# Altium schematic sheet Sensors.SchDoc
size 420 x 297 mm
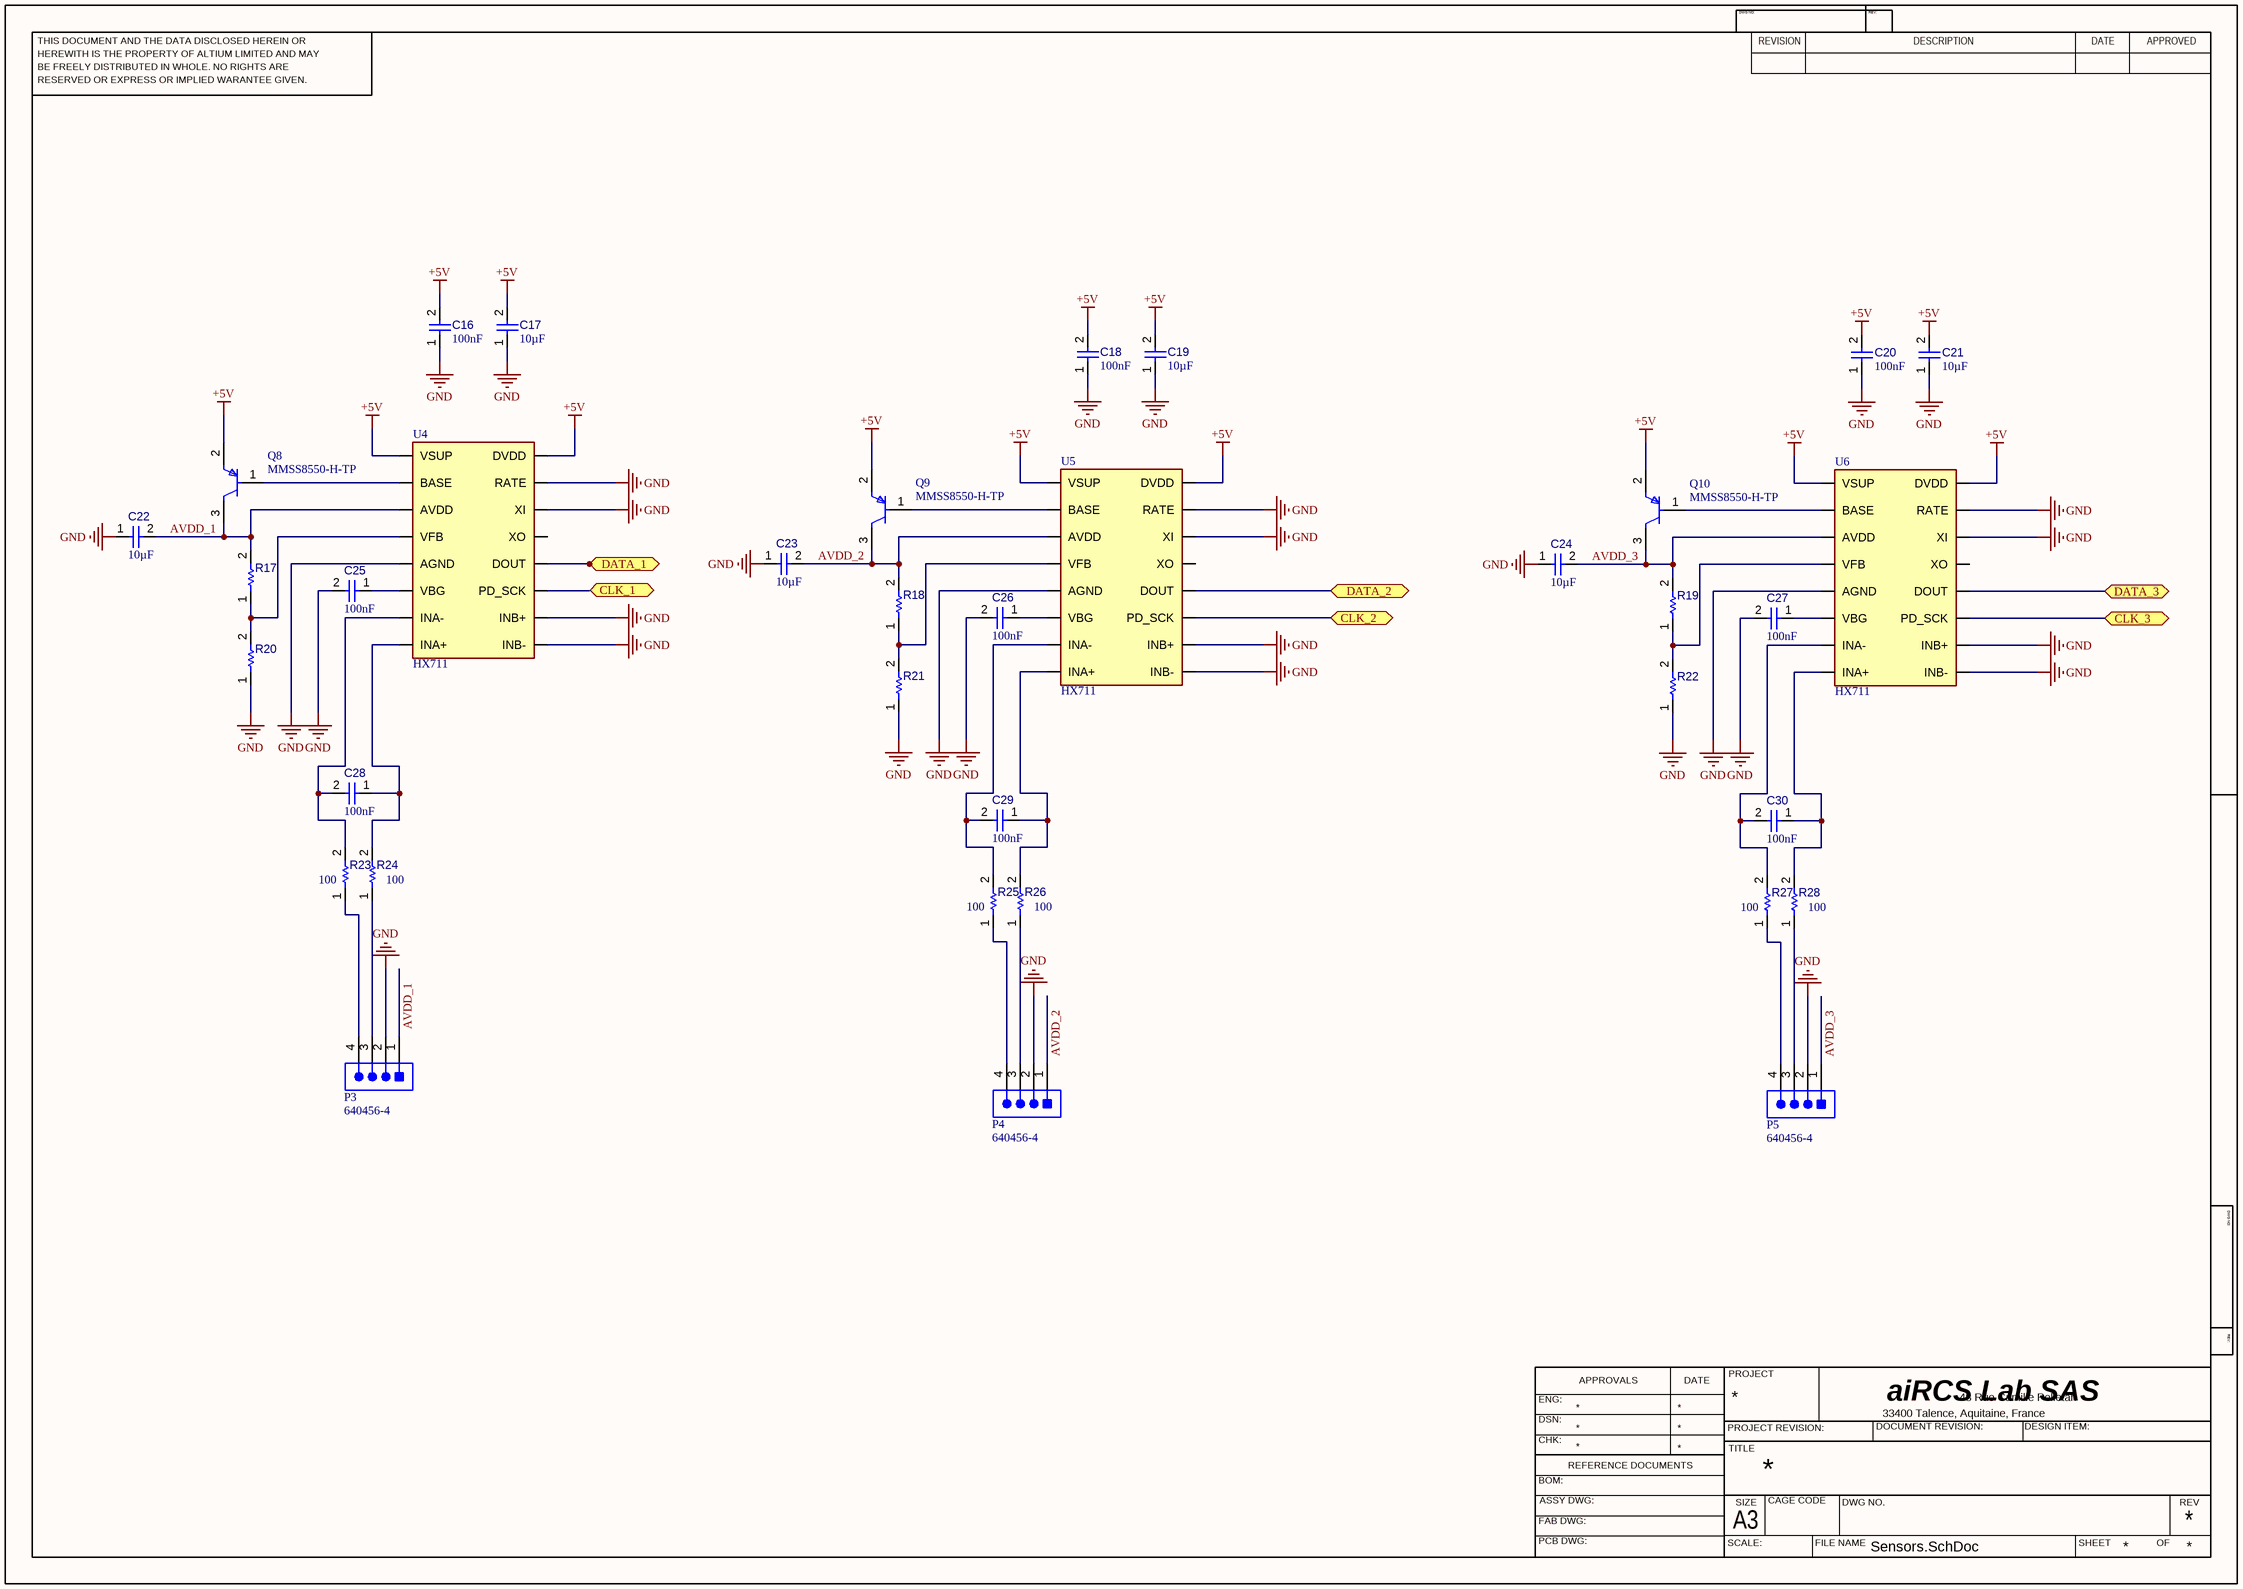
[diagram p0: Sensors.SchDoc]

## Parts
C16  value 100nF  [CAPC0402(1005)60_L]  (hidden comment: Capacitor 100nF +/-20% 50V 0402)
C17  value 10µF  [CAPC0402(1005)60_L]  (hidden comment: Capacitor 10µF +/-40% 6.3V 0402)
C18  value 100nF  [CAPC0402(1005)60_L]  (hidden comment: Capacitor 100nF +/-20% 50V 0402)
C19  value 10µF  [CAPC0402(1005)60_L]  (hidden comment: Capacitor 10µF +/-40% 6.3V 0402)
C20  value 100nF  [CAPC0402(1005)60_L]  (hidden comment: Capacitor 100nF +/-20% 50V 0402)
C21  value 10µF  [CAPC0402(1005)60_L]  (hidden comment: Capacitor 10µF +/-40% 6.3V 0402)
C22  value 10µF  [CAPC0402(1005)60_L]  (hidden comment: Capacitor 10µF +/-40% 6.3V 0402)
C23  value 10µF  [CAPC0402(1005)60_L]  (hidden comment: Capacitor 10µF +/-40% 6.3V 0402)
C24  value 10µF  [CAPC0402(1005)60_L]  (hidden comment: Capacitor 10µF +/-40% 6.3V 0402)
C25  value 100nF  [CAPC0402(1005)60_L]  (hidden comment: Capacitor 100nF +/-20% 50V 0402)
C26  value 100nF  [CAPC0402(1005)60_L]  (hidden comment: Capacitor 100nF +/-20% 50V 0402)
C27  value 100nF  [CAPC0402(1005)60_L]  (hidden comment: Capacitor 100nF +/-20% 50V 0402)
C28  value 100nF  [CAPC0402(1005)60_L]  (hidden comment: Capacitor 100nF +/-20% 50V 0402)
C29  value 100nF  [CAPC0402(1005)60_L]  (hidden comment: Capacitor 100nF +/-20% 50V 0402)
C30  value 100nF  [CAPC0402(1005)60_L]  (hidden comment: Capacitor 100nF +/-20% 50V 0402)
P3  640456-4  [TECO-640456-4]
P4  640456-4  [TECO-640456-4]
P5  640456-4  [TECO-640456-4]
Q8  MMSS8550-H-TP  [FP-SOT-23-IPC_B]
Q9  MMSS8550-H-TP  [FP-SOT-23-IPC_B]
Q10  MMSS8550-H-TP  [FP-SOT-23-IPC_B]
R17  RES  [RESC0402(1005)_L]  (value not drawn)
R18  RES  [RESC0402(1005)_L]  (value not drawn)
R19  RES  [RESC0402(1005)_L]  (value not drawn)
R20  RES  [RESC0402(1005)_L]  (value not drawn)
R21  RES  [RESC0402(1005)_L]  (value not drawn)
R22  RES  [RESC0402(1005)_L]  (value not drawn)
R23  100  [RESC0402(1005)_L]
R24  100  [RESC0402(1005)_L]
R25  100  [RESC0402(1005)_L]
R26  100  [RESC0402(1005)_L]
R27  100  [RESC0402(1005)_L]
R28  100  [RESC0402(1005)_L]
U4  HX711  [SOP127P600X180-16N]
U5  HX711  [SOP127P600X180-16N]
U6  HX711  [SOP127P600X180-16N]

## Ports
CLK_1 (bidir), CLK_2 (bidir), CLK_3 (bidir), DATA_1 (bidir), DATA_2 (bidir), DATA_3 (bidir)

## Nets
+5V: C16.2 C17.2 C18.2 C19.2 C20.2 C21.2 Q8.2(E) Q9.2(E) Q10.2(E) U4.1(VSUP) U4.16(DVDD) U5.1(VSUP) U5.16(DVDD) U6.1(VSUP) U6.16(DVDD)
GND: C16.1 C17.1 C18.1 C19.1 C20.1 C21.1 C22.1 C23.1 C24.1 C25.2 C26.2 C27.2 P3.2 P4.2 P5.2 R20.1 R21.1 R22.1 U4.5(AGND) U4.9(INB-) U4.10(INB+) U4.14(XI) U4.15(RATE) U5.5(AGND) U5.9(INB-) U5.10(INB+) U5.14(XI) U5.15(RATE) U6.5(AGND) U6.9(INB-) U6.10(INB+) U6.14(XI) U6.15(RATE)
AVDD_1: C22.2 P3.1 Q8.3(C) R17.2 U4.3(AVDD)
AVDD_2: C23.2 P4.1 Q9.3(C) R18.2 U5.3(AVDD)
AVDD_3: C24.2 P5.1 Q10.3(C) R19.2 U6.3(AVDD)
CLK_1: U4.11(PD_SCK) ; port CLK_1
CLK_2: U5.11(PD_SCK) ; port CLK_2
CLK_3: U6.11(PD_SCK) ; port CLK_3
DATA_1: U4.12(DOUT) ; port DATA_1
DATA_2: U5.12(DOUT) ; port DATA_2
DATA_3: U6.12(DOUT) ; port DATA_3
NetC25_1: C25.1 U4.6(VBG)
NetC26_1: C26.1 U5.6(VBG)
NetC27_1: C27.1 U6.6(VBG)
NetC28_1: C28.1 R24.2 U4.8(INA+)
NetC28_2: C28.2 R23.2 U4.7(INA-)
NetC29_1: C29.1 R26.2 U5.8(INA+)
NetC29_2: C29.2 R25.2 U5.7(INA-)
NetC30_1: C30.1 R28.2 U6.8(INA+)
NetC30_2: C30.2 R27.2 U6.7(INA-)
NetP3_3: P3.3 R24.1
NetP3_4: P3.4 R23.1
NetP4_3: P4.3 R26.1
NetP4_4: P4.4 R25.1
NetP5_3: P5.3 R28.1
NetP5_4: P5.4 R27.1
NetQ8_1: Q8.1(B) U4.2(BASE)
NetQ9_1: Q9.1(B) U5.2(BASE)
NetQ10_1: Q10.1(B) U6.2(BASE)
NetR17_1: R17.1 R20.2 U4.4(VFB)
NetR18_1: R18.1 R21.2 U5.4(VFB)
NetR19_1: R19.1 R22.2 U6.4(VFB)

Not connected (* = marked no-connect by the designer): U4 13(XO); U5 13(XO); U6 13(XO)

## Notes on the sheet
- THIS DOCUMENT AND THE DATA DISCLOSED HEREIN OR
- HEREWITH IS THE PROPERTY OF ALTIUM LIMITED AND MAY
- DWG NO:
- REVISION
- REV:
- DESCRIPTION
- DATE
- APPROVED
- BE FREELY DISTRIBUTED IN WHOLE. NO RIGHTS ARE
- RESERVED OR EXPRESS OR IMPLIED WARANTEE GIVEN.
- ENG:
- APPROVALS
- PROJECT
- aiRCS Lab SAS
- 33400 Talence, Aquitaine, France
- 48 Rue Camille Pelletan
- DSN:
- CHK:
- REFERENCE DOCUMENTS
- PROJECT REVISION:
- TITLE
- DOCUMENT REVISION:
- DESIGN ITEM:
- BOM:
- FAB DWG:
- PCB DWG:
- ASSY DWG:
- SCALE:
- A3
- SIZE
- CAGE CODE
- FILE NAME
- DWG NO.
- SHEET
- OF
- REV

## Library data of the parts
C16 C18 C20 C25-C30 = CMP-001-00067-3: Chip Capacitor, 100nF +/-20%, 50V, 0402, Thickness 0.6 mm; Tolerance: 10%; Min Operating Temperature: -55°C; Pins: 2; Case/Package: 0402; Max Operating Temperature: 85°C; Voltage Rating: 50V; Mounting Technology: SMT
C17 C19 C21-C24 = CMP-001-00074-3: Chip Capacitor, 10µF +/-40%, 6.3V, 0402, Thickness 0.6 mm; Tolerance: 10%; Case/Package: 0402; Pins: 2; Mounting Technology: SMT; Voltage Rating: 6.3V; Max Operating Temperature: 85°C; Min Operating Temperature: -55°C
P3-P5 = CMP-2000-05419-1: Male Header, Pitch 2.54 mm, 1 x 4 Position, Height 10.03 mm, Tail Length 3.56 mm, RoHS, Bulk; Manufacturer: TE Connectivity; Material, Housing: Polyester; Primary Type: InterconnectSystem; Mount Angle: Vertical; Color, Housing: White; Current, Rating: 5 / A; Agency Approvals: CSA,UL; Contact Termination Area Plating: Tin; Temperature, Operating: -55to+105 / degC; Standards: RoHSCompliant,ELVCompliant,UL94V-0; Number of Positions: 4; Brand/Series: MTA-100Series; Angle: Straight; Pin Spacing: 0.1 / "; Material, Contact: CopperAlloy; Connector Type: MTA-100; Special Features: Pinstrip; Mounting Hole Size: 0.04 / "; Contact Centerline Spacing: 0.100 / in.; Voltage, Rating: 250 / V; Manufacturer URL: http://www.te.com/; Length, Pin: 0.14 / "; Length, Overall: 0.4 / "; Color: White; Flammability Rating: UL94V-0; Mounting Type: PCMount; Termination: Solder; Datasheet URL: https://datasheet.ciiva.com/16286/eng-ds-82056-mta-0608-16286228.pdf; Number of Contacts: 4; Contact Shape: Square; Contact Mating Area Plating: Tin; Length, Terminal Post: 0.14 / in.; Size, Post: 0.025 / in.; Contact Plating: Tin; Type: PCBPlug; Datasheet Version: Dec-14; Number of Rows: 1
Q8-Q10 = CMP-56214-000002-1: TRANS PNP 25V 1.5A SOT23; Emitter Base Voltage (VEBO): 1.6V; Collector Base Voltage (VCBO): 40V; Collector Emitter Saturation Voltage: 500mV; Max Power Dissipation: 625mW; Transition Frequency: 100MHz; Element Configuration: Single; hFE Min: 40; Polarity: PNP; Lead Free: Lead Free; Max Breakdown Voltage: 25V; Package Quantity: 1; Min Operating Temperature: -55°C; Case/Package: SOT-23; Max Collector Current: 1.5A; Mount: Surface Mount; Packaging: Tape and Reel; Collector Emitter Voltage (VCEO): 500mV; Max Operating Temperature: 150°C; Gain Bandwidth Product: 100MHz; Collector Emitter Breakdown Voltage: 25V
R17-R22 = CMP-009-00062-5: Resistor 0402; Mounting Technology: SMT; Pins: 2; Case/Package: 0402
R23-R28 = CMP-009-00062-5: Mounting Technology: SMT; Value: 100; Pins: 2; Case/Package: 0402
U4-U6 = HX711: <h3>AVIA Semiconductor HX711 - ADC</h3> <p>24-Bit Analog-to-Digital Converter for Weigh Scales <li><a href=â€https://cdn.sparkfun.com/datasheets/Sensors/ForceFlex/hx711_english.pdfâ€>Datasheet</a></li> </p> <p><b>SparkFun Products:</b> <ul><li><a href=â€https://www.sparkfun.com/products/13879â€>SparkFun Load Cell Amplifier - HX711 </a></li> </ul></p>; MF: AVIA SEMICONDUCTOR; Price: None; Availability: Unavailable; Value: *; SnapEDA_Link: https://www.snapeda.com/parts/HX711/AVIA%20SEMICONDUCTOR/view-part/4804859/?ref=snap; Package: None; MP: HX711; Check_prices: https://www.snapeda.com/parts/HX711/AVIA%20SEMICONDUCTOR/view-part/4804859/?ref=eda